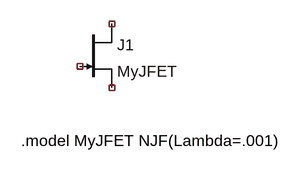
[diagram p0: schematic Draft1.asc]
Draft1.asc, the LTspice schematic file:
Version 4
SHEET 1 880 680
SYMBOL njf 128 128 R0
SYMATTR InstName J1
SYMATTR Value MyJFET
TEXT 40 304 Left 2 !.model MyJFET NJF(Lambda=.001)

The netlist it stands for:
* Draft1.asc
J1 NC_01 NC_02 NC_03 MyJFET
.model NJF NJF
.model PJF PJF
.lib standard.jft
.model MyJFET NJF(Lambda=.001)
.backanno
.end